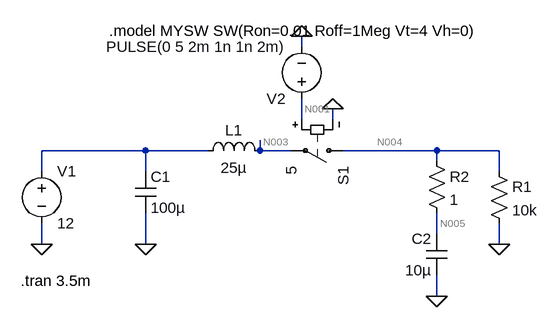
[diagram p0: schematic AC-adapter-transient-analysis.asc]
AC-adapter-transient-analysis.asc, the LTspice schematic file:
Version 4
SHEET 1 880 680
WIRE 480 -64 480 -80
WIRE 480 48 480 16
WIRE 528 48 528 32
WIRE 240 96 80 96
WIRE 336 96 240 96
WIRE 416 96 416 80
WIRE 464 96 416 96
WIRE 688 96 544 96
WIRE 784 96 688 96
WIRE 688 112 688 96
WIRE 80 128 80 96
WIRE 240 128 240 96
WIRE 784 128 784 96
WIRE 688 224 688 192
WIRE 80 240 80 208
WIRE 240 240 240 192
WIRE 784 240 784 208
WIRE 688 320 688 288
FLAG 528 32 0
FLAG 480 -80 0
FLAG 80 240 0
FLAG 240 240 0
FLAG 688 320 0
FLAG 784 240 0
SYMBOL voltage 80 112 R0
WINDOW 123 0 0 Left 0
WINDOW 39 0 0 Left 0
SYMATTR InstName V1
SYMATTR Value 12
SYMBOL cap 224 128 R0
SYMATTR InstName C1
SYMATTR Value 100µ
SYMBOL ind 320 112 R270
WINDOW 0 32 56 VTop 2
WINDOW 3 5 56 VBottom 2
SYMATTR InstName L1
SYMATTR Value 25µ
SYMATTR SpiceLine Rser=1
SYMBOL cap 704 288 R180
WINDOW 0 24 56 Left 2
WINDOW 3 24 8 Left 2
SYMATTR InstName C2
SYMATTR Value 10µ
SYMBOL sw 560 96 R90
SYMATTR InstName S1
SYMATTR Value 5
SYMATTR SpiceModel MYSW
SYMBOL voltage 480 32 R180
WINDOW 123 0 0 Left 0
WINDOW 39 0 0 Left 0
SYMATTR InstName V2
SYMATTR Value PULSE(0 5 2m 1n 1n 2m)
SYMBOL res 768 112 R0
SYMATTR InstName R1
SYMATTR Value 10k
SYMBOL res 672 96 R0
SYMATTR InstName R2
SYMATTR Value 1
TEXT 48 296 Left 2 !.tran 3.5m
TEXT 184 -88 Left 2 !.model MYSW SW(Ron=0.01 Roff=1Meg Vt=4 Vh=0)

The netlist it stands for:
* AC-adapter-transient-analysis.asc
V1 N002 0 12
C1 N002 0 100µ
L1 N002 N003 25µ Rser=1
C2 0 N005 10µ
S1 N004 N003 N001 0 MYSW 5
V2 N001 0 PULSE(0 5 2m 1n 1n 2m)
R1 N004 0 10k
R2 N004 N005 1
.tran 3.5m
.model MYSW SW(Ron=0.01 Roff=1Meg Vt=4 Vh=0)
.backanno
.end

* Results of the author's LTspice run, read from the files saved beside the schematic
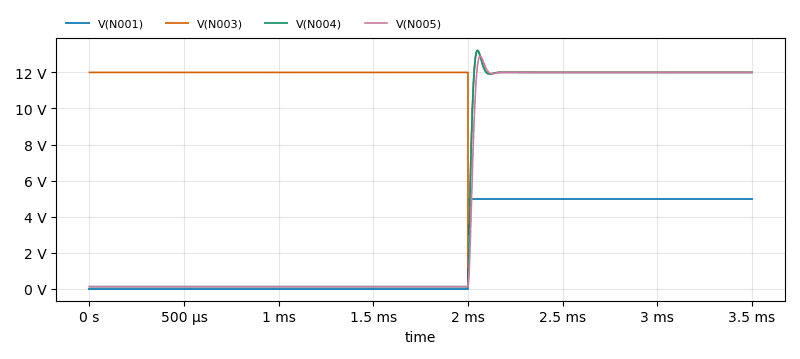
[diagram p1: Transient Analysis of AC-adapter-transient-analysis.asc, plotted from the saved traces]
* Transient Analysis, 1 run:
*   V(N001): min 0 V, max 5 V, average 2.143 V, rms 3.273 V, last 5 V
*   V(N003): min 118.8 mV, max 13.22 V, average 11.97 V, rms 11.98 V, last 12 V
*   V(N004): min 118.8 mV, max 13.21 V, average 5.176 V, rms 7.825 V, last 12 V
*   V(N005): min 118.8 mV, max 12.9 V, average 5.142 V, rms 7.793 V, last 12 V